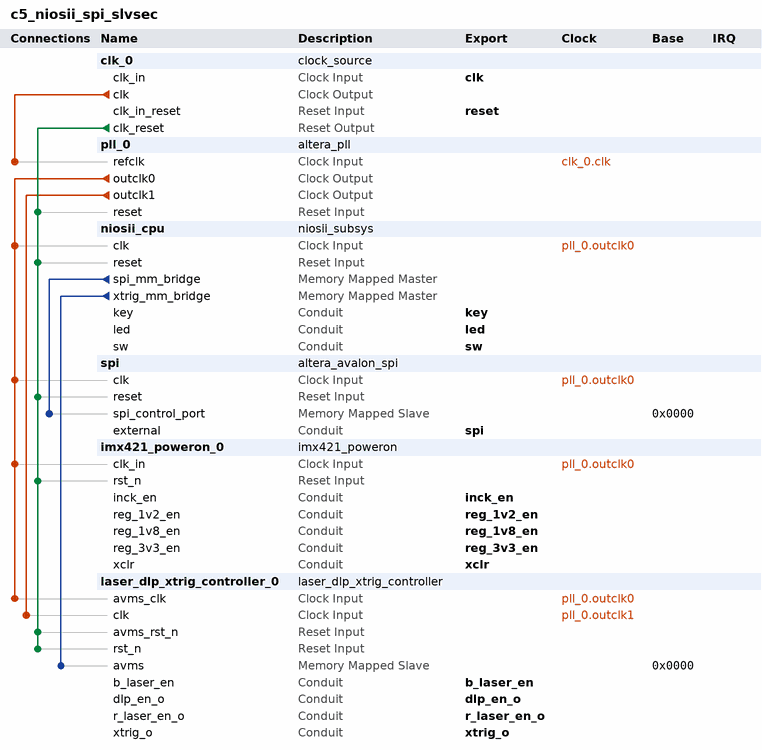
[diagram p0: system contents]
# Platform Designer (Qsys) system c5_niosii_spi_slvsec, Cyclone V 5CSEBA6U23I7
# Parameters at their usual value, and those the tool derives, are not listed.
package require -exact qsys 18.1
create_system c5_niosii_spi_slvsec
set_project_property DEVICE_FAMILY {Cyclone V}
set_project_property DEVICE 5CSEBA6U23I7

add_instance clk_0 clock_source 18.1
set_instance_parameter_value clk_0 clockFrequency 50000000

add_instance pll_0 altera_pll 18.1
set_instance_parameter_value pll_0 gui_device_speed_grade 1
set_instance_parameter_value pll_0 gui_number_of_clocks 2
set_instance_parameter_value pll_0 gui_operation_mode direct
set_instance_parameter_value pll_0 gui_output_clock_frequency0 100.0
set_instance_parameter_value pll_0 gui_output_clock_frequency1 1.0
set_instance_parameter_value pll_0 gui_pll_mode {Integer-N PLL}
set_instance_parameter_value pll_0 gui_reference_clock_frequency 50.0
set_instance_parameter_value pll_0 gui_use_locked false

add_instance niosii_cpu niosii_subsys 1.0

add_instance spi altera_avalon_spi 18.1
set_instance_parameter_value spi clockPhase 1
set_instance_parameter_value spi clockPolarity 1
set_instance_parameter_value spi dataWidth 8
set_instance_parameter_value spi lsbOrderedFirst true
set_instance_parameter_value spi masterSPI true
set_instance_parameter_value spi numberOfSlaves 1
set_instance_parameter_value spi targetClockRate 1000000

add_instance imx421_poweron_0 imx421_poweron 1.0
set_instance_parameter_value imx421_poweron_0 TIMEOUT_THRESHOLD 1000000

add_instance laser_dlp_xtrig_controller_0 laser_dlp_xtrig_controller 1.0
set_instance_parameter_value laser_dlp_xtrig_controller_0 DATA_WIDTH 32
set_instance_parameter_value laser_dlp_xtrig_controller_0 DLP_PULSE_WIDTH 200

# connections
add_connection clk_0.clk pll_0.refclk clock
add_connection pll_0.outclk0 imx421_poweron_0.clk_in clock
add_connection pll_0.outclk0 laser_dlp_xtrig_controller_0.avms_clk clock
add_connection pll_0.outclk0 niosii_cpu.clk clock
add_connection pll_0.outclk0 spi.clk clock
add_connection pll_0.outclk1 laser_dlp_xtrig_controller_0.clk clock
add_connection clk_0.clk_reset imx421_poweron_0.rst_n reset
add_connection clk_0.clk_reset laser_dlp_xtrig_controller_0.avms_rst_n reset
add_connection clk_0.clk_reset laser_dlp_xtrig_controller_0.rst_n reset
add_connection clk_0.clk_reset niosii_cpu.reset reset
add_connection clk_0.clk_reset pll_0.reset reset
add_connection clk_0.clk_reset spi.reset reset
add_connection niosii_cpu.spi_mm_bridge spi.spi_control_port avalon
set_connection_parameter_value niosii_cpu.spi_mm_bridge/spi.spi_control_port baseAddress 0x0000
add_connection niosii_cpu.xtrig_mm_bridge laser_dlp_xtrig_controller_0.avms avalon
set_connection_parameter_value niosii_cpu.xtrig_mm_bridge/laser_dlp_xtrig_controller_0.avms baseAddress 0x0000

# exported interfaces
add_interface b_laser_en conduit end
set_interface_property b_laser_en EXPORT_OF laser_dlp_xtrig_controller_0.b_laser_en
add_interface clk clock sink
set_interface_property clk EXPORT_OF clk_0.clk_in
add_interface dlp_en_o conduit end
set_interface_property dlp_en_o EXPORT_OF laser_dlp_xtrig_controller_0.dlp_en_o
add_interface inck_en conduit end
set_interface_property inck_en EXPORT_OF imx421_poweron_0.inck_en
add_interface key conduit end
set_interface_property key EXPORT_OF niosii_cpu.key
add_interface led conduit end
set_interface_property led EXPORT_OF niosii_cpu.led
add_interface r_laser_en_o conduit end
set_interface_property r_laser_en_o EXPORT_OF laser_dlp_xtrig_controller_0.r_laser_en_o
add_interface reg_1v2_en conduit end
set_interface_property reg_1v2_en EXPORT_OF imx421_poweron_0.reg_1v2_en
add_interface reg_1v8_en conduit end
set_interface_property reg_1v8_en EXPORT_OF imx421_poweron_0.reg_1v8_en
add_interface reg_3v3_en conduit end
set_interface_property reg_3v3_en EXPORT_OF imx421_poweron_0.reg_3v3_en
add_interface reset reset sink
set_interface_property reset EXPORT_OF clk_0.clk_in_reset
add_interface spi conduit end
set_interface_property spi EXPORT_OF spi.external
add_interface sw conduit end
set_interface_property sw EXPORT_OF niosii_cpu.sw
add_interface xclr conduit end
set_interface_property xclr EXPORT_OF imx421_poweron_0.xclr
add_interface xtrig_o conduit end
set_interface_property xtrig_o EXPORT_OF laser_dlp_xtrig_controller_0.xtrig_o

set_interconnect_requirement {$system} qsys_mm.clockCrossingAdapter HANDSHAKE
set_interconnect_requirement {$system} qsys_mm.enableEccProtection FALSE
set_interconnect_requirement {$system} qsys_mm.insertDefaultSlave FALSE
set_interconnect_requirement {$system} qsys_mm.maxAdditionalLatency 1

save_system c5_niosii_spi_slvsec.qsys
